# Altium schematic sheet LED_Driver.SchDoc
size A
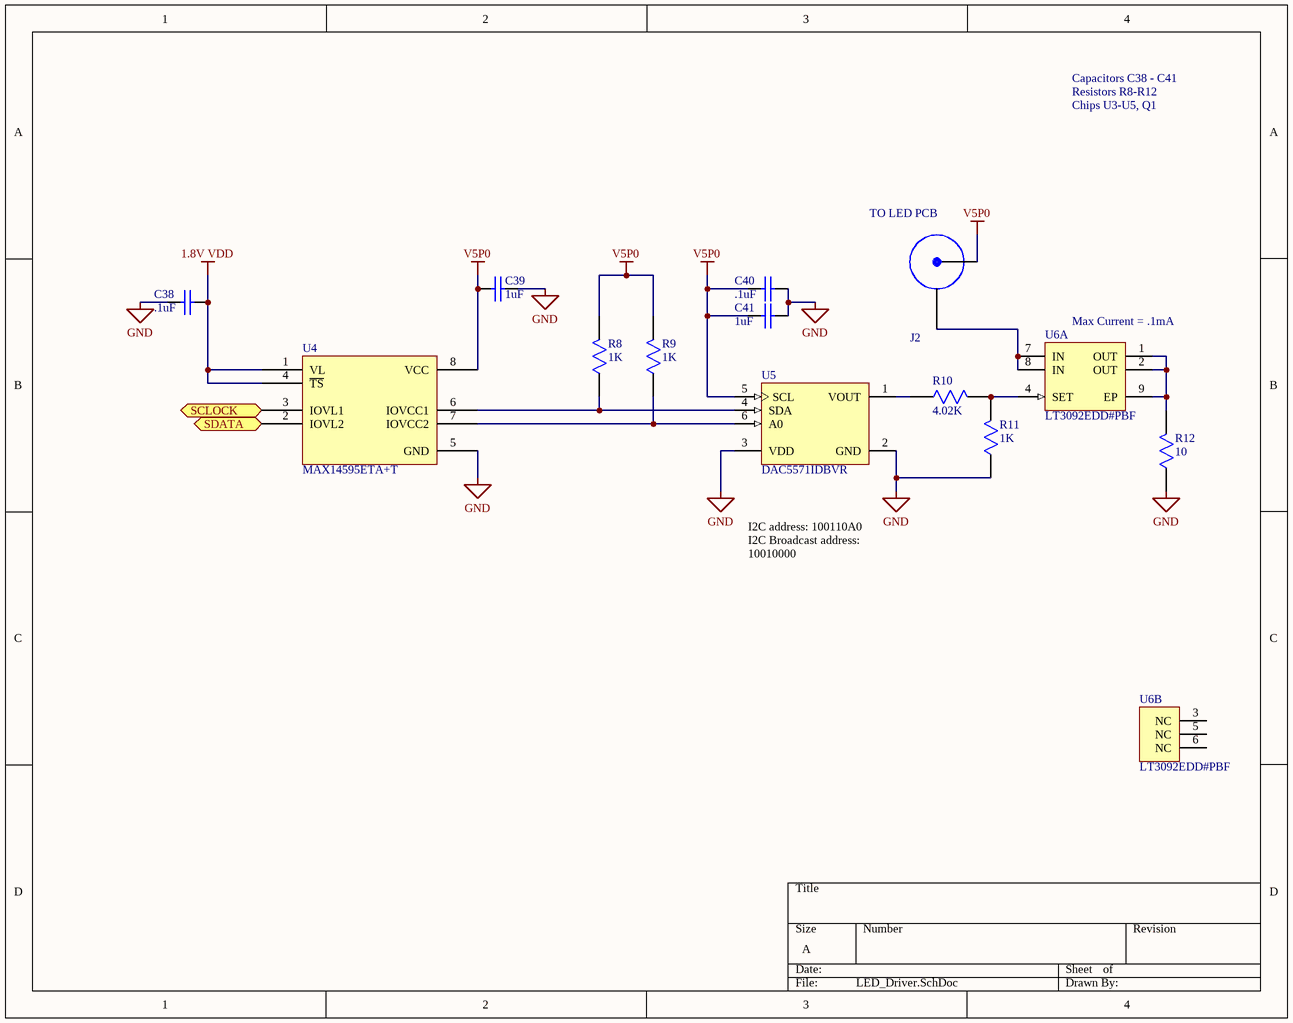
[diagram p0: LED_Driver.SchDoc]

## Parts
C38  .1uF  [SMD CAP 0402]
C39  1uF  [SMD CAP 0402]
C40  .1uF  [SMD CAP 0402]
C41  1uF  [SMD CAP 0402]
J2  Coax Connector  [Coax Direct Solder ThroughHoles]  (value not drawn)
R8  1K  [SMD RES 0402]
R9  1K  [SMD RES 0402]
R10  4.02K  [SMD RES 0402]
R11  1K  [SMD RES 0402]
R12  10  [SMD RES 0402]
U4  MAX14595ETA+T  [8 TDFN]
U5  DAC5571IDBVR  [TI-DBV6_M]
U6  LT3092EDD#PBF  [LT-DD-8_V]  (parts A,B of 2)

## Ports
SCLOCK (in), SDATA (bidir)

## Nets
1.8V VDD: C38.1 U4.1(VL) U4.4(~{TS})
GND: C38.0 C39.1 C40.1 C41.1 R11.0 R12.0 U4.5(GND) U5.2(GND) U5.3(VDD)
V5P0: C39.0 C40.0 C41.0 J2.0 R8.1 R9.1 U4.8(VCC) U5.5(SCL)
SCLOCK: U4.3(IOVL1) ; port SCLOCK
SDATA: U4.2(IOVL2) ; port SDATA
NetJ2_1: J2.1 U6.7(IN) U6.8(IN)
NetR8_0: R8.0 U4.6(IOVCC1) U5.4(SDA)
NetR9_0: R9.0 U4.7(IOVCC2) U5.6(A0)
NetR10_0: R10.0 U5.1(VOUT)
NetR10_1: R10.1 R11.1 U6.4(SET)
NetR12_1: R12.1 U6.1(OUT) U6.2(OUT) U6.9(EP)

Not connected (* = marked no-connect by the designer): U6 3(NC) 5(NC) 6(NC)

## Notes on the sheet
- Capacitors C38 - C41
- Resistors R8-R12
- Chips U3-U5, Q1
- (near J2) TO LED PCB
- (near U6) Max Current = .1mA
- I2C address: 100110A0
  I2C Broadcast address: 10010000

## Library data of the parts
C38-C41 = Capacitor: Value: C?
R8-R12 = Resistor: Value: ?
U4 = MAX14595ETA+T: Level Translator
U5 = DAC5571IDBVR: Low-Power, 8-Bit DAC with High-Speed I2C Input, -40 to 105 degC, 6-pin SOT23 (DBV6), Green (RoHS & no Sb/Br); Manufacturer: Texas Instruments; DAC Channels: 1; DNL(Max)(+/-LSB): 0.25; Interface: Serial I2C; Power Consumption(Typ)(mW): 0.4; Resolution(Bits): 8; SubFamily: Precision DAC (=<10MSPS); DatasheetVersion: SLAS405A; PackageVersion: 4073253-5/K, 03/2006; PackageReference: DBV6; PackageDescription: 6-Pin Plastic Small Outline, Body 1.6 x 2.9 mm, Pitch 0.95 mm; Supplier 1: Digi-Key; Supplier Part Number 1: DAC5571IDBVR-ND; Supplier 2: Mouser; Supplier Part Number 2: 595-DAC5571IDBVR; Eco-Plan: Green (RoHS & no Sb/Br); INL(Max)(+/-LSB): 1; Settling Time(us): 8; Mounting Technology: Surface Mount; Code_JEDEC: MO-178; PartNumber: DAC5571IDBVR; ComponentLink1Description: Manufacturer URL; ComponentLink1URL: http://www.ti.com/; ComponentLink2Description: Datasheet; ComponentLink2URL: http://www.ti.com/general/docs/lit/getliterature.tsp?genericPartNumber=DAC5571&fileType=pdf; ComponentLink3Description: Package Specification; ComponentLink3URL: http://www.ti.com/litv/pdf/mpds026h
U6 = LT3092EDD#PBF: 200 mA Two-Terminal Programmable Current Source, 0.3 mA Isupply, 8-pin SON (DD-8), -40 to 125 degC, Pb-Free; Manufacturer: Linear Technology; Extended Temp: E, I, MP; Initial Accuracy(%): 1; Isupply(mA): 0.3; Output Current Range: 0.5 mA to 200 mA; Vin Max(V): 40; Vin Min(V): 1.2; DatasheetVersion: Rev. B; PackageVersion: Jun-10; PackageReference: DD-8; PackageDescription: 8-Pin Plastic DFN, Body 3 x 3 mm, Pitch 0.5 mm; Supplier 1: Digi-Key; Supplier Part Number 1: LT3092EDD#PBF-ND; Supplier 2: Farnell; Supplier Part Number 2: 2295468; Supplier 3: Newark; Supplier Part Number 3: 72R5810; RoHS: TRUE; Mounting Technology: Surface Mount; Code_JEDEC: MO-229; PartNumber: LT3092EDD#PBF; ComponentLink1Description: Manufacturer URL; ComponentLink1URL: http://www.linear.com/; ComponentLink2Description: Datasheet; ComponentLink2URL: http://cds.linear.com/docs/en/datasheet/3092fb.pdf; ComponentLink3Description: Package Specification; ComponentLink3URL: http://cds.linear.com/docs/en/packaging/DFN_8_05-08-1698.pdf